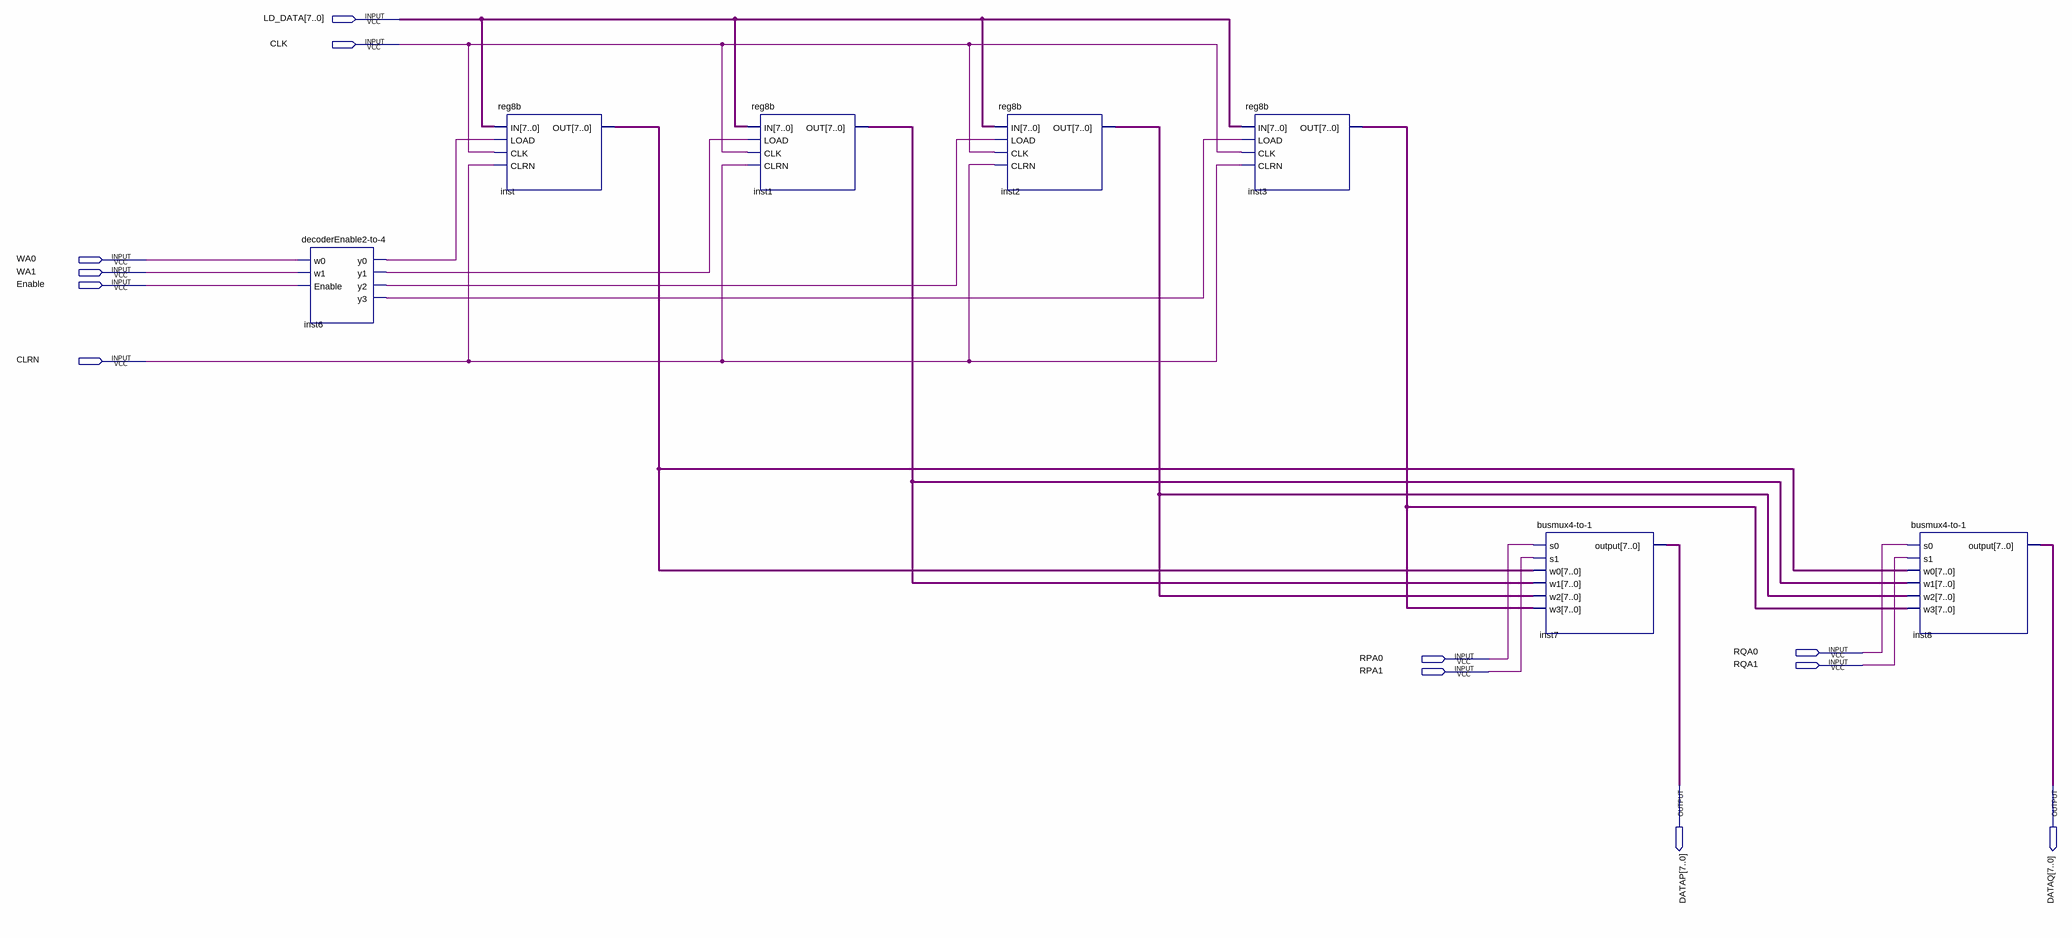
[diagram p0: schematic sheet]
// Quartus schematic regfile.bdf as structural Verilog: 7 symbols, 12 pins
module regfile (
  input  [7:0] LD_DATA,
  input  CLK,
  input  WA0,
  input  WA1,
  input  Enable,
  input  CLRN,
  input  RQA0,
  input  RPA0,
  input  RQA1,
  input  RPA1,
  output [7:0] DATAP,
  output [7:0] DATAQ
);

  wire inst6_y0, inst6_y1, inst6_y2, inst6_y3;
  wire [7:0] inst1_out, inst2_out, inst3_out, inst_out;

  \decoderEnable2-to-4  inst6 (
    .w0(WA0), .w1(WA1), .Enable(Enable), .y0(inst6_y0), .y1(inst6_y1), .y2(inst6_y2), .y3(inst6_y3));
  reg8b inst (.IN(LD_DATA), .LOAD(inst6_y0), .CLK(CLK), .CLRN(CLRN), .OUT(inst_out));
  reg8b inst1 (.IN(LD_DATA), .LOAD(inst6_y1), .CLK(CLK), .CLRN(CLRN), .OUT(inst1_out));
  reg8b inst2 (.IN(LD_DATA), .LOAD(inst6_y2), .CLK(CLK), .CLRN(CLRN), .OUT(inst2_out));
  reg8b inst3 (.IN(LD_DATA), .LOAD(inst6_y3), .CLK(CLK), .CLRN(CLRN), .OUT(inst3_out));
  \busmux4-to-1  inst7 (
    .s0(RPA0), .w0(inst_out), .s1(RPA1), .w1(inst1_out), .w2(inst2_out), .w3(inst3_out), .\output (DATAP));
  \busmux4-to-1  inst8 (
    .s0(RQA0), .w0(inst_out), .s1(RQA1), .w1(inst1_out), .w2(inst2_out), .w3(inst3_out), .\output (DATAQ));
endmodule
